# EAGLE design input_buff (EAGLE 6.0)
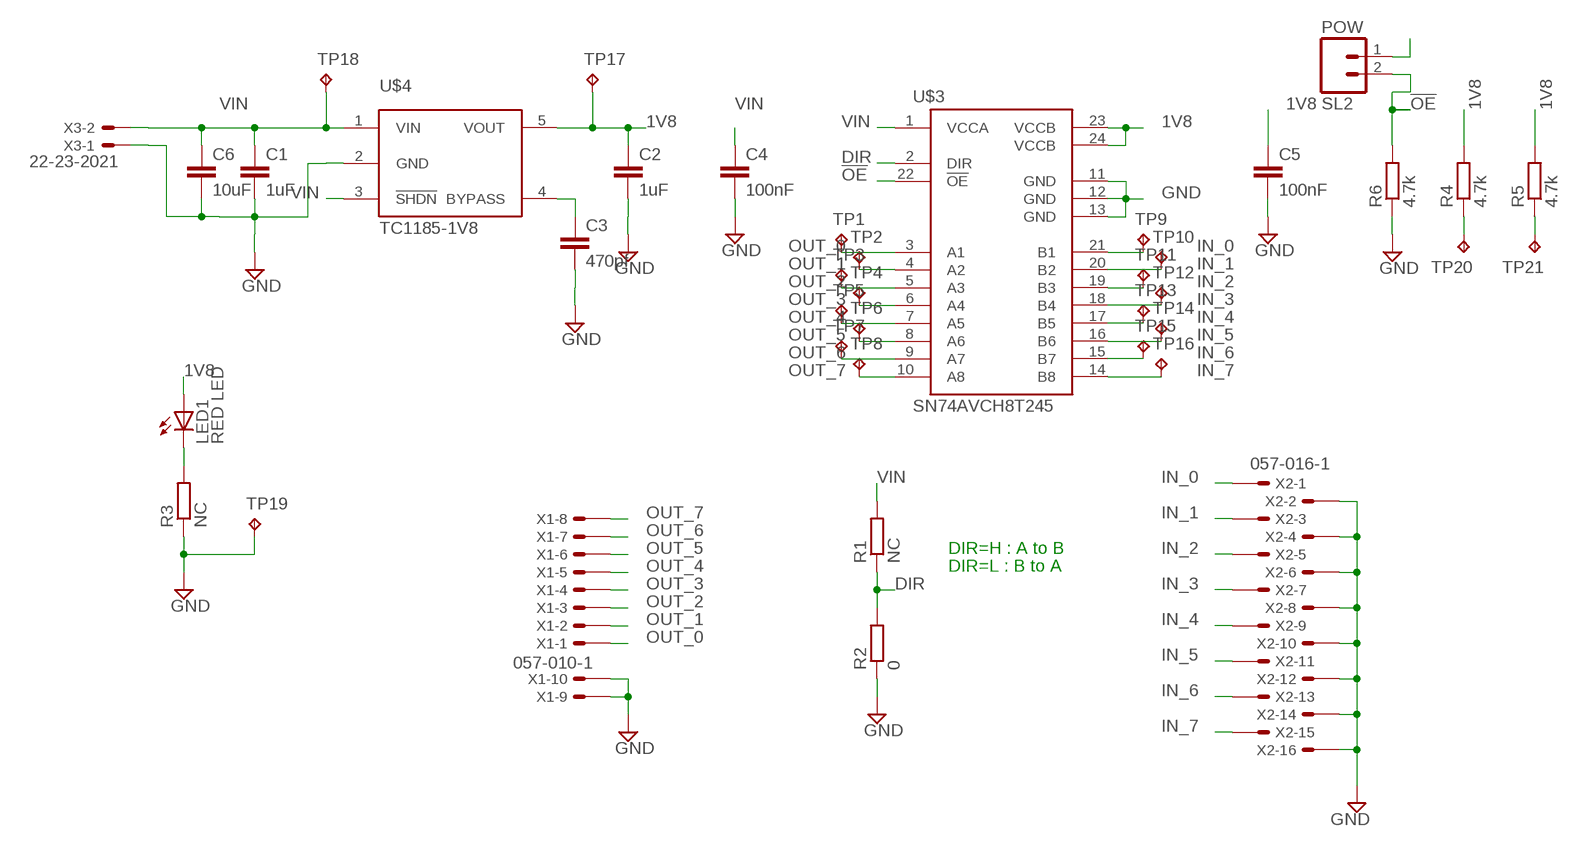
[diagram p0: schematic, sheet 1]

## Parts
C1  1uF  C-EUC0805  [C0805]
C2  1uF  C-EUC0805  [C0805]
C3  470pf  C-EUC0805  [C0805]
C4  100nF  C-EUC0805  [C0805]
C5  100nF  C-EUC0805  [C0805]
C6  10uF  C-EUC1210  [C1210]
LED1  RED LED  LEDCHIPLED_0805  [CHIPLED_0805]
R1  NC  R-EU_M0805  [M0805]
R2  0  R-EU_M0805  [M0805]
R3  NC  R-EU_M0805  [M0805]
R4  4.7k  R-EU_M0805  [M0805]
R5  4.7k  R-EU_M0805  [M0805]
R6  4.7k  R-EU_M0805  [M0805]
SL2  POW  M02  [02P]
TP1  TPTP10R  [TP10R]
TP2  TPTP10R  [TP10R]
TP3  TPTP10R  [TP10R]
TP4  TPTP10R  [TP10R]
TP5  TPTP10R  [TP10R]
TP6  TPTP10R  [TP10R]
TP7  TPTP10R  [TP10R]
TP8  TPTP10R  [TP10R]
TP9  TPTP10R  [TP10R]
TP10  TPTP10R  [TP10R]
TP11  TPTP10R  [TP10R]
TP12  TPTP10R  [TP10R]
TP13  TPTP10R  [TP10R]
TP14  TPTP10R  [TP10R]
TP15  TPTP10R  [TP10R]
TP16  TPTP10R  [TP10R]
TP17  TPTP10R  [TP10R]
TP18  TPTP10R  [TP10R]
TP19  TPTP10R  [TP10R]
TP20  TPTP10R  [TP10R]
TP21  TPTP10R  [TP10R]
U$3  SN74AVCH8T245  [TSSOP24]
U$4  TC1185-1V8  [SOT23-5]
X1  057-010-1  [057-010-1]
X2  057-016-1  [057-016-1]
X3  22-23-2021  [22-23-2021]

## Nets
1V8: C2.1 C5.1 LED1.A R4.2 R5.2 TP17.TP U$3.23(VCCB) U$3.24(VCCB) U$4.5(VOUT)
!OE: R6.2 SL2.2 U$3.22(!OE)
DIR: R1.1 R2.2 U$3.2(DIR)
GND: C1.2 C2.2 C3.2 C4.2 C5.2 C6.2 R2.1 R3.1 R6.1 TP19.TP U$3.11(GND) U$3.12(GND) U$3.13(GND) U$4.2(GND) X1.9 X1.10 X2.2 X2.4 X2.6 X2.8 X2.10 X2.12 X2.14 X2.16 X3.1
IN_0: TP9.TP U$3.21(B1) X2.1
IN_1: TP10.TP U$3.20(B2) X2.3
IN_2: TP11.TP U$3.19(B3) X2.5
IN_3: TP12.TP U$3.18(B4) X2.7
IN_4: TP13.TP U$3.17(B5) X2.9
IN_5: TP14.TP U$3.16(B6) X2.11
IN_6: TP15.TP U$3.15(B7) X2.13
IN_7: TP16.TP U$3.14(B8) X2.15
N$1: R4.1 TP20.TP
N$2: C3.1 U$4.4(BYPASS)
N$3: LED1.C R3.2
N$4: R5.1 TP21.TP
OUT_0: TP1.TP U$3.3(A1) X1.1
OUT_1: TP2.TP U$3.4(A2) X1.2
OUT_2: TP3.TP U$3.5(A3) X1.3
OUT_3: TP4.TP U$3.6(A4) X1.4
OUT_4: TP5.TP U$3.7(A5) X1.5
OUT_5: TP6.TP U$3.8(A6) X1.6
OUT_6: TP7.TP U$3.9(A7) X1.7
OUT_7: TP8.TP U$3.10(A8) X1.8
VIN: C1.1 C4.1 C6.1 R1.2 SL2.1 TP18.TP U$3.1(VCCA) U$4.1(VIN) U$4.3(!SHDN) X3.2

## Notes on the sheet
- DIR=H : A to B
- DIR=L : B to A

## Library data of the parts
C1-C6 = resistor:C-EU: CAPACITOR, European symbol
LED1 = led:LED: LED OSRAM: - CHIPLED LG R971, LG N971, LY N971, LG Q971, LY Q971, LO R971, LY R971 LH N974, LH R974 LS Q976, LO Q976, LY Q976 LO Q996 - Hyper CHIPLED LW Q18S LB Q993, LB Q99A, LB R99A - SideLED LS A670, LO A670, LY A670, LG A670, LP A670 LB A673, LV A673, LT A673, LW A673 LH A674 LY A675 LS A676, LA A676, LO A676, LY A676, LW A676 LS A679, LY A679, LG A679 - Hyper Micro SIDELED® LS Y876, LA Y876, LO Y876, LY Y876 LT Y87S - SmartLED LW L88C, LW L88S LB L89C, LB L89S, LG L890 LS L89K, LO L89K, LY L89K LS L896, LA L896, LO L896, LY L896 - TOPLED LS T670, LO T670, LY T670, LG T670, LP T670 LSG T670, LSP T670, LSY T670, LOP T670, LYG T670 LG T671, LOG T671, LSG T671 LB T673, LV T673, LT T673, LW T673 LH T674 LS T676, LA T676, LO T676, LY T676, LB T676, LH T676, LSB T676, LW T676 LB T67C, LV T67C, LT T67C, LS T67K, LO T67K, LY T67K, LW E67C LS E67B, LA E67B, LO E67B, LY E67B, LB E67C, LV E67C, LT E67C LW T67C LS T679, LY T679, LG T679 LS T770, LO T770, LY T770, LG T770, LP T770 LB T773, LV T773, LT T773, LW T773 LH T774 LS E675, LA E675, LY E675, LS T675 LS T776, LA T776, LO T776, LY T776, LB T776 LHGB T686 LT T68C, LB T68C - Hyper Mini TOPLED® LB M676 - Mini TOPLED Santana® LG M470 LS M47K, LO M47K, LY M47K Source: http://www.osram.convergy.de LUXEON: - LUMILED® LXK2-PW12-R00, LXK2-PW12-S00, LXK2-PW14-U00, LXK2-PW14-V00 LXK2-PM12-R00, LXK2-PM12-S00, LXK2-PM14-U00 LXK2-PE12-Q00, LXK2-PE12-R00, LXK2-PE12-S00, LXK2-PE14-T00, LXK2-PE14-U00 LXK2-PB12-K00, LXK2-PB12-L00, LXK2-PB12-M00, LXK2-PB14-N00, LXK2-PB14-P00, LXK2-PB14-Q00 LXK2-PR12-L00, LXK2-PR12-M00, LXK2-PR14-Q00, LXK2-PR14-R00 LXK2-PD12-Q00, LXK2-PD12-R00, LXK2-PD12-S00 LXK2-PH12-R00, LXK2-PH12-S00 LXK2-PL12-P00, LXK2-PL12-Q00, LXK2-PL12-R00 Source: www.luxeon.com KINGBRIGHT: KA-3528ASYC Source: www.kingbright.com
R1-R6 = resistor:R-EU_: RESISTOR, European symbol
SL2 = con-amp-quick:M02: AMP QUICK CONNECTOR; OC_FARNELL: unknown; OC_NEWARK: unknown
TP1-TP21 = testpad:TP: Test pad
U$3 = input_buff:SN74AVCH8T245: 8-BIT DUAL-SUPPLY BUS TRANSCEIVER WITH CONFIGURABLE VOLTAGE TRANSLATION AND 3-STATE OUTPUTS; MF: TEXAS INSTRUMENTS
U$4 = input_buff:TC1185: 150 mA CMOS LDO with Shutdown and Reference Bypass
X1 = con-panduit:057-010-: CONNECTOR 10-pin series 057 contact pc board low profile headers; OC_FARNELL: unknown; OC_NEWARK: unknown
X2 = con-panduit:057-016-: CONNECTOR 10-pin series 057 contact pc board low profile headers; OC_FARNELL: unknown; OC_NEWARK: unknown
X3 = con-molex:22-23-2021: .100" (2.54mm) Center Header - 2 Pin; MF: MOLEX; MPN: 22-23-2021; OC_FARNELL: 1462926; OC_NEWARK: 25C3832

## Net classes
1 power: width 0.254 mm

## Board
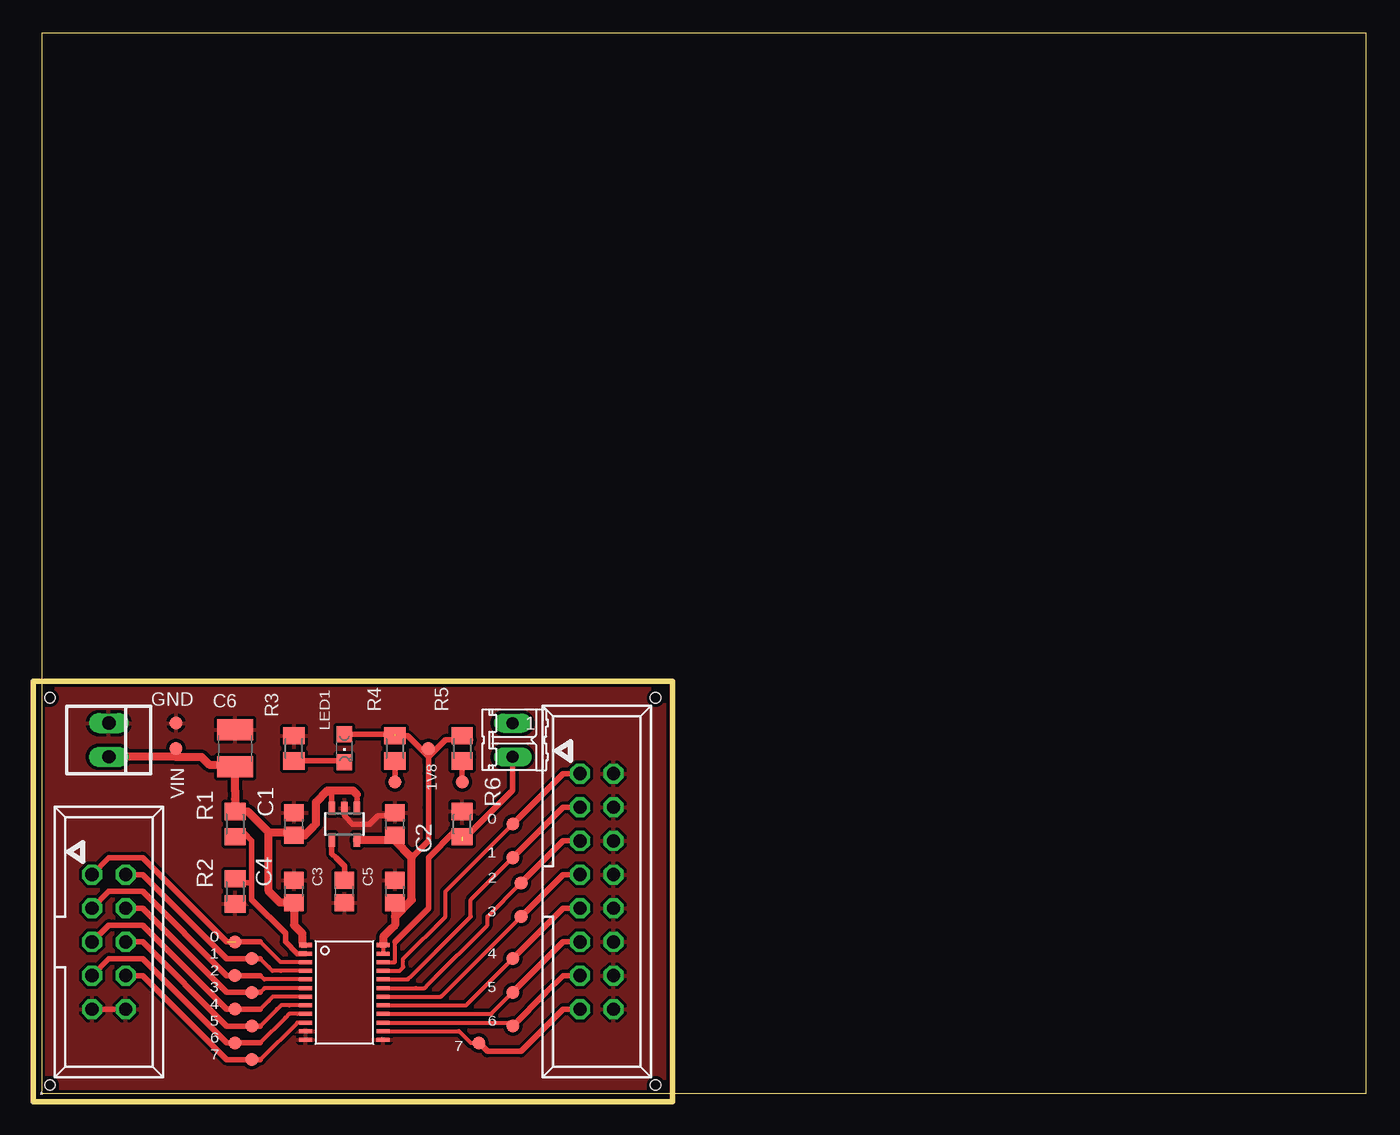
[diagram p1: board, top side]
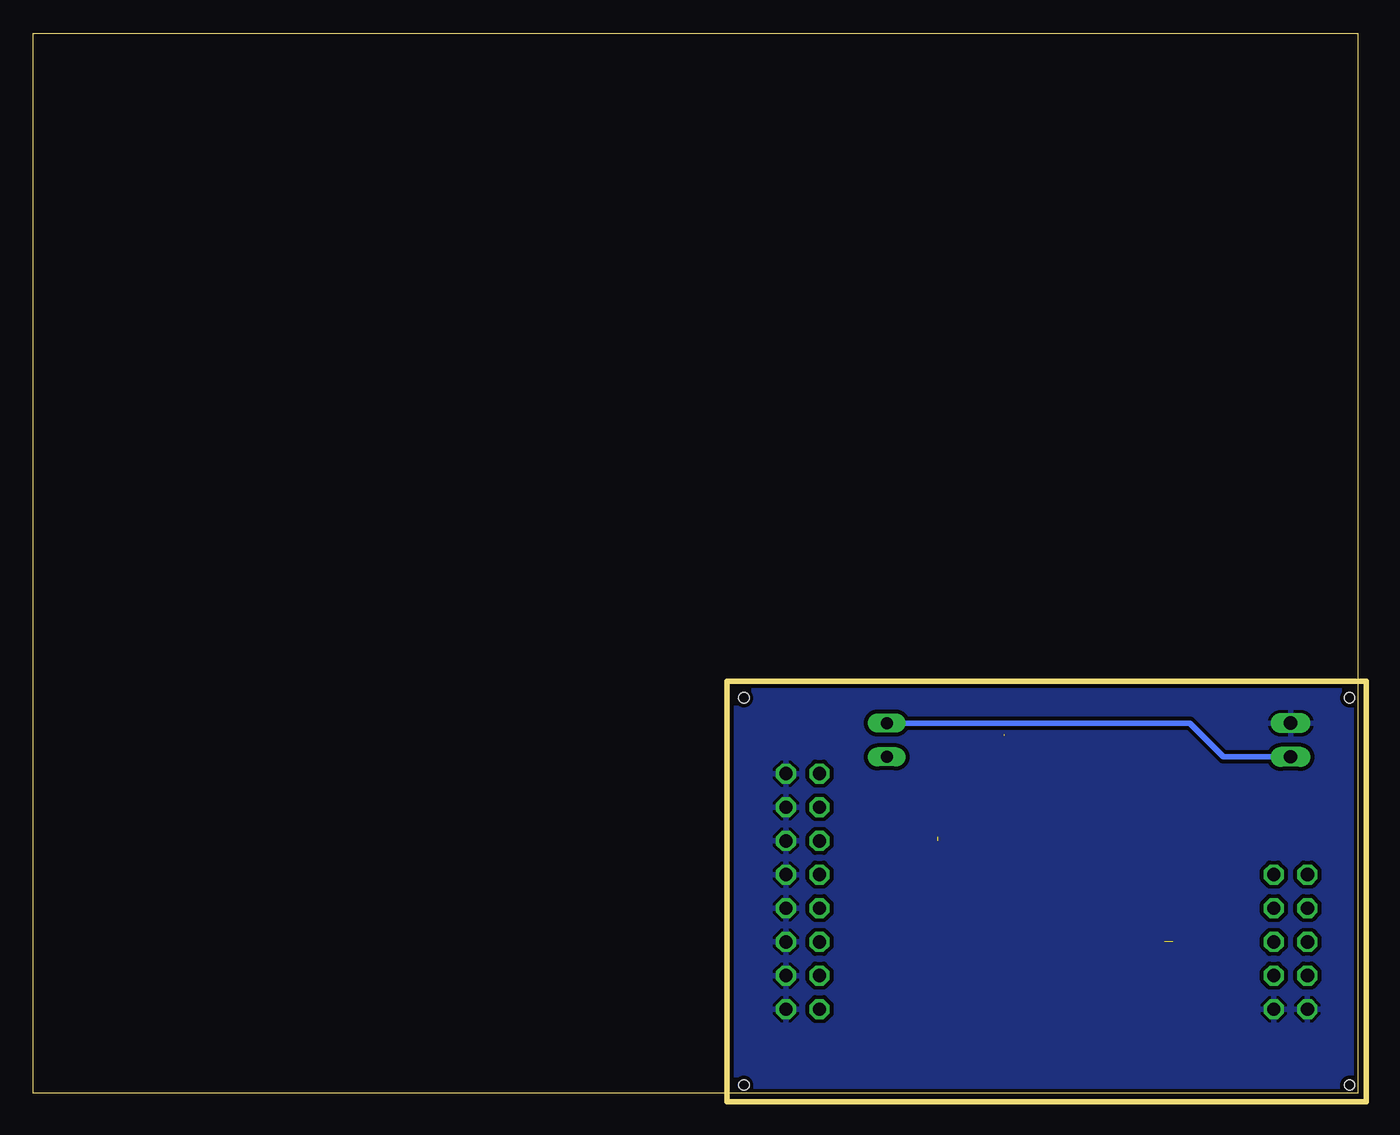
[diagram p2: board, bottom side, seen from below]

Size 100.64 x 80.64 mm. Coordinates in mm from the lower left corner, seen from the top.
Outline: 0.64,0.64 100.64,0.64 100.64,80.64 0.64,80.64 0.64,0.64
Outline: 48.26,31.75 0,31.75 0,0 48.26,0 48.26,31.75
Copper layers (1*16): Top 0.035mm / dielectric 1.5mm / Bottom 0.035mm
Design rules: minimum track width 6mil, minimum drill 12mil, track to track 6mil, track to pad 6mil, pad to pad 6mil, via to via 6mil, smd to smd 0mil, copper to edge 10mil, drill to drill 10mil, minimum pad ring 10mil, minimum via ring 6mil, stop-mask expansion 2mil, vias tented up to drill 100mil, thermal gap 10mil
Holes 0.8 mm at 1.27,1.27 1.27,30.48 46.99,30.48 46.99,1.27

### Footprints (pad centres in the part's own frame; a part is rotated, then mirrored left to right if it is on the bottom)
C0805 = smd 1.3 x 1.5: 1 -0.85,0; 2 0.85,0
C1210 = smd 1.6 x 2.7: 1 -1.4,0; 2 1.4,0
CHIPLED_0805 = smd 1.2 x 1.2: A 0,-1.05; C 0,1.05
M0805 = smd 1.3 x 1.6: 1 -0.95,0; 2 0.95,0
02P = drill 0.914 long: 1 -1.27,0; 2 1.27,0
TP10R = smd 1 x 1: TP 0,0
TSSOP24 = smd 0.305 x 0.991: 1 -3.575,-2.918; 2 -2.925,-2.918; 3 -2.275,-2.918; 4 -1.625,-2.918; 5 -0.975,-2.918; 6 -0.325,-2.918; 7 0.325,-2.918; 8 0.975,-2.918; 9 1.625,-2.918; 10 2.275,-2.918; 11 2.925,-2.918; 12 3.575,-2.918; 13 3.575,2.918; 14 2.925,2.918; 15 2.275,2.918; 16 1.625,2.918; 17 0.975,2.918; 18 0.325,2.918; 19 -0.325,2.918; 20 -0.975,2.918; 21 -1.625,2.918; 22 -2.275,2.918; 23 -2.925,2.918; 24 -3.575,2.918
SOT23-5 = smd 0.5 x 1: 1 -0.95,-1.2; 2 0,-1.2; 3 0.95,-1.2; 4 0.95,1.2; 5 -0.95,1.2
057-010-1 = drill 1 octagon: 1 -5.08,-1.27; 2 -5.08,1.27; 3 -2.54,-1.27; 4 -2.54,1.27; 5 0,-1.27; 6 0,1.27; 7 2.54,-1.27; 8 2.54,1.27; 9 5.08,-1.27; 10 5.08,1.27
057-016-1 = drill 1 octagon: 1 -8.89,-1.27; 2 -8.89,1.27; 3 -6.35,-1.27; 4 -6.35,1.27; 5 -3.81,-1.27; 6 -3.81,1.27; 7 -1.27,-1.27; 8 -1.27,1.27; 9 1.27,-1.27; 10 1.27,1.27; 11 3.81,-1.27; 12 3.81,1.27; 13 6.35,-1.27; 14 6.35,1.27; 15 8.89,-1.27; 16 8.89,1.27
22-23-2021 = drill 1 long: 1 -1.27,0; 2 1.27,0

### Placement (x,y rotation side)
C1  19.69,20.96 90 top
C2  27.31,20.96 90 top
C3  23.5,15.88 270 top
C4  19.69,15.88 90 top
C5  27.31,15.88 90 top
C6  15.24,26.67 90 top
LED1  23.5,26.67 180 top
R1  15.24,20.96 90 top
R2  15.24,15.88 90 top
R3  19.69,26.67 270 top
R4  27.31,26.67 90 top
R5  32.38,26.67 90 top
R6  32.38,20.96 270 top
SL2  36.2,27.31 270 top
TP1  15.24,12.06 0 top
TP2  16.51,10.79 0 top
TP3  15.24,9.53 0 top
TP4  16.51,8.26 0 top
TP5  15.24,6.98 0 top
TP6  16.51,5.71 0 top
TP7  15.24,4.45 0 top
TP8  16.51,3.17 0 top
TP9  36.2,20.96 0 top
TP10  36.2,18.42 0 top
TP11  36.83,16.51 0 top
TP12  36.83,13.97 0 top
TP13  36.2,10.79 0 top
TP14  36.2,8.26 0 top
TP15  36.2,5.71 0 top
TP16  33.66,4.45 0 top
TP17  29.85,26.67 0 top
TP18  10.79,26.67 0 top
TP19  10.79,28.58 0 top
TP20  27.31,24.13 0 top
TP21  32.38,24.13 0 top
U$3  23.5,8.26 270 top
U$4  23.5,20.96 180 top
X1  5.71,12.06 270 top
X2  42.54,15.88 270 top
X3  5.71,27.31 270 top

### Tracks (layer width: path | path; a pad name or v marks a point on that pad's centre or on a via)
1V8  (1 unrouted)
  Top 0.305: U$3.24 U$3.23 | R5.2 33.02,27.31
  Top 0.406: 26.96,19.76 C2.1 | C2.1 27.31,20.32 | U$3.24 | 29.85,26.04 29.85,24.77 | 29.85,24.77 29.85,22.23 29.85,19.69 28.58,18.42 | 29.85,25.62 29.85,26.04 | LED1.A 27.31,27.72 27.31,27.94 | R4.2 28.26,27.62 29.85,26.04 | 33.02,27.31 31.12,27.31 29.85,26.04 | 27.31,13.33 27.31,13.97 | 27.31,19.69 C2.1 | TP17.TP 29.85,24.77
  Top 0.61: U$4.5 26.96,19.76 | U$3.24 26.42,12.45 27.07,13.1 27.31,13.33 C5.1 | 27.31,13.97 28.58,15.24 28.58,18.42 27.31,19.69
!OE  (1 unrouted)
  Top 0.305: U$3.22 27.31,10.53 27.31,10.79 27.31,12.06
  Top 0.406: 27.31,12.06 29.85,14.61 29.85,17.78 29.85,18.42 31.75,20.32 32.07,20.32 R6.2 | SL2.2 36.2,23.5 32.38,19.69
DIR
  Top 0.305: 15.24,20.32 15.88,20.32
  Top 0.406: U$3.2 19.94,11.18 19.05,12.06 19.05,12.7 16.51,15.24 16.51,16.51 | 15.88,20.32 16.51,19.69 16.51,16.51 | 16.51,16.51 15.24,16.51 R2.2 15.24,17.15 | 15.24,20.32 R1.1
GND
  Top 0.406: U$4.2 23.5,21.59 24.13,20.96 25.4,20.96 26.04,21.59 27.31,21.59 | X1.10 X1.9 | C5.2 27.09,16.51
  pour Bottom (isolate 0.305): 0,0 0,31.75 48.26,31.75 48.26,0
  pour Top (isolate 0.254): 48.26,0 48.26,31.75 0,31.75 0,0
IN_0
  Top 0.305: TP9.TP 31.12,15.88 31.12,13.97 27.94,10.79 27.94,10.16 27.66,9.88 U$3.21
  Top 0.406: X2.1 40,24.77 TP9.TP
IN_1
  Top 0.305: U$3.20 28.28,9.23 28.58,9.53 33.02,13.97 33.02,15.24 TP10.TP
  Top 0.406: TP10.TP 40,22.23 X2.3
IN_2
  Top 0.305: U$3.19 28.9,8.58 29.54,8.58 29.85,8.89 34.29,13.33 34.29,13.97 TP11.TP
  Top 0.406: X2.5 40,19.69 TP11.TP
IN_3
  Top 0.305: U$3.18 30.79,7.93 TP12.TP
  Top 0.406: TP12.TP 40,17.15 X2.7
IN_4
  Top 0.305: U$3.17 32.68,7.28 TP13.TP
  Top 0.406: TP13.TP 40,14.61 X2.9
IN_5
  Top 0.305: U$3.16 34.57,6.63 TP14.TP
  Top 0.406: X2.11 40,12.06 TP14.TP
IN_6
  Top 0.305: U$3.15 35.93,5.98 TP15.TP
  Top 0.406: TP15.TP 38.73,8.26 40,9.53 X2.13
IN_7
  Top 0.305: U$3.14 32.13,5.33 32.38,5.08 33.02,4.45 TP16.TP
  Top 0.406: X2.15 40,6.98 37.46,4.45 36.83,3.81 34.29,3.81 TP16.TP
N$1
  Top 0.406: R4.1 TP20.TP
N$2
  Top 0.406: U$4.4 22.55,19.37 22.55,18.73 22.86,18.42 23.5,17.78 C3.1
N$3
  Top 0.406: R3.2 23.5,25.72 | 23.5,25.72 LED1.C | LED1.C 23.5,25.4 | 23.5,25.72 LED1.C
N$4
  Top 0.305: 32.38,26.04 33.02,26.04
  Top 0.406: R5.1 32.38,26.04 R5.1 | R5.1 TP21.TP
OUT_0  (1 unrouted)
  Top 0.305: U$3.3 19.32,10.53 18.68,10.53 17.78,11.43 | 18.42,10.79 17.78,11.43 | 17.78,11.43 17.15,12.06
  Top 0.406: X1.1 5.71,18.42 8.26,18.42 14.61,12.06 17.15,12.06
OUT_1
  Top 0.305: U$3.4 18.7,9.88 18.06,9.88 17.78,10.16 | 17.78,10.16 17.15,10.79 | 17.15,10.79 17.78,10.16 | 17.78,10.16 17.15,10.79 | 17.15,10.79 TP2.TP
  Top 0.406: X1.2 8.26,17.15 14.61,10.79 TP2.TP 17.15,10.79
OUT_2
  Top 0.305: U$3.5 17.44,9.23 17.15,9.53
  Top 0.406: X1.3 5.71,15.88 8.26,15.88 14.61,9.53 TP3.TP 17.15,9.53
OUT_3
  Top 0.305: U$3.6 17.47,8.58 17.15,8.26 | TP4.TP 15.24,8.26
  Top 0.406: 17.15,8.26 TP4.TP 15.24,8.26 14.61,8.26 8.26,14.61 X1.4
OUT_4
  Top 0.305: U$3.7 18.73,7.93 18.09,7.93 17.78,7.62 17.15,6.98 | 14.61,6.98 13.97,7.62 | TP5.TP 15.88,6.98
  Top 0.406: X1.5 5.71,13.33 8.26,13.33 13.97,7.62 14.61,6.98 TP5.TP 15.88,6.98 17.15,6.98
OUT_5
  Top 0.305: U$3.8 19.35,7.28 18.71,7.28 18.42,6.98 17.15,5.71 | TP6.TP 15.24,5.71
  Top 0.406: X1.6 8.26,12.06 14.61,5.71 15.24,5.71 TP6.TP 17.15,5.71
OUT_6
  Top 0.305: U$3.9 19.96,6.63 19.33,6.63 19.05,6.35 17.15,4.45 | TP7.TP 14.61,4.45
  Top 0.406: X1.7 5.71,10.79 8.26,10.79 14.61,4.45 TP7.TP 17.15,4.45
OUT_7
  Top 0.305: U$3.10 19.95,5.98 17.15,3.17 | TP8.TP 15.88,3.17
  Top 0.406: X1.8 8.26,9.53 14.61,3.17 15.88,3.17 TP8.TP 17.15,3.17
VIN
  Top 0.406: 20.5,20.11 C1.1 19.47,20.32 | 24.45,21.91 U$4.1 24.45,23.18 | U$4.3 22.55,23.18 22.23,23.5 | U$3.1 20.32,11.83 20.32,12.06 | 20.32,12.7 20.32,12.44 | 10.79,26.04 TP18.TP | 15.24,22.23 15.24,22.86 | 15.24,22.86 15.24,23.5 C6.1 | R1.2 15.24,22.86 | 21.35,20.96 21.15,20.76 21.35,20.96
  Top 0.61: 20.5,20.11 21.15,20.76 | 21.35,20.96 21.35,22.62 22.23,23.5 23.5,23.5 24.13,23.5 24.45,23.18 | 20.32,12.7 19.69,13.33 C4.1 18.63,15.03 17.78,15.88 17.78,20.32 | 17.78,20.32 19.47,20.32 | R1.2 16.2,21.91 17.78,20.32 | 15.24,22.23 15.24,22.86 15.24,23.5 C6.1 15.24,25.4 13.33,25.4 12.7,26.04 10.79,26.04 X3.2 | 20.32,12.44 20.32,12.06
  Bottom 0.406: SL2.1 19.05,28.58 13.33,28.58 11.75,26.99 | 11.75,26.99 10.79,26.04 | X3.2 10.79,26.04 | 10.79,26.04 11.75,26.99

### Text on the board
tNames: GND | 1V8 | VIN | 0 | 1 | 2 | 3 | 0 | 1 | 4 | 2 | 3 | 5 | 4 | 5 | 6 | 6 | 7 | 7